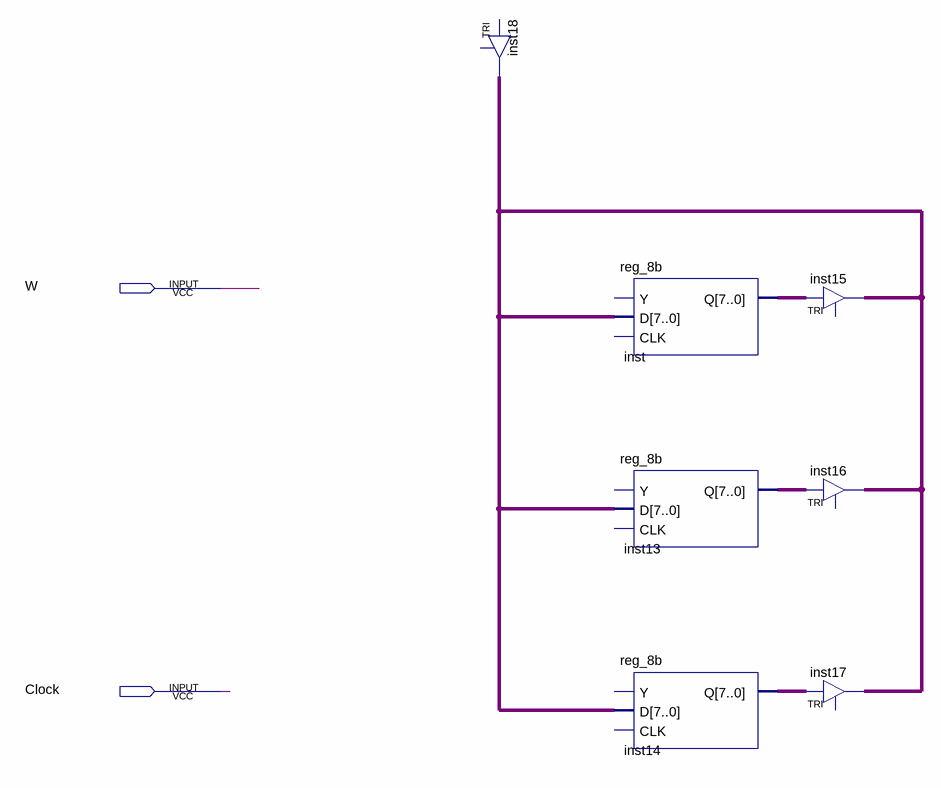
[diagram p0: schematic sheet]
// Quartus schematic Machine.bdf as structural Verilog: 7 symbols, 2 pins
module Machine (
  input  W,
  input  Clock
);

  wire [7:0] inst13_q, inst14_q, inst18_out, inst_q;

  TRI inst18[7:0] (.OUT(inst18_out));  // open: IN, OE
  reg_8b inst (.D(inst18_out), .Q(inst_q));  // open: Y, CLK
  reg_8b inst13 (.D(inst18_out), .Q(inst13_q));  // open: Y, CLK
  reg_8b inst14 (.D(inst18_out), .Q(inst14_q));  // open: Y, CLK
  TRI inst15[7:0] (.IN(inst_q), .OUT(inst18_out));  // open: OE
  TRI inst16[7:0] (.IN(inst13_q), .OUT(inst18_out));  // open: OE
  TRI inst17[7:0] (.IN(inst14_q), .OUT(inst18_out));  // open: OE
endmodule
